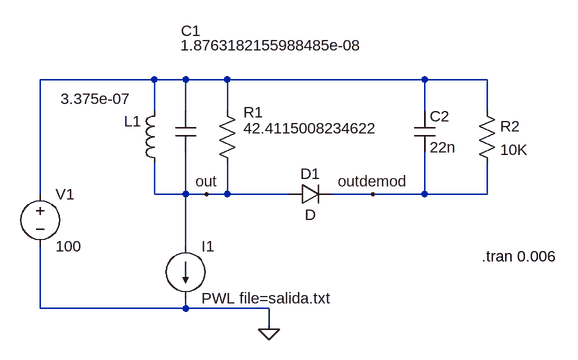
[diagram p0: schematic Doblador Frecuencia.asc]
Doblador Frecuencia.asc, the LTspice schematic file:
Version 4
SHEET 1 880 680
WIRE -48 -160 -224 -160
WIRE 0 -160 -48 -160
WIRE 64 -160 0 -160
WIRE 368 -160 64 -160
WIRE 464 -160 368 -160
WIRE -48 -112 -48 -160
WIRE 0 -112 0 -160
WIRE 64 -112 64 -160
WIRE 368 -112 368 -160
WIRE 464 -112 464 -160
WIRE -224 16 -224 -160
WIRE -48 16 -48 -32
WIRE 0 16 0 -48
WIRE 0 16 -48 16
WIRE 32 16 0 16
WIRE 64 16 64 -32
WIRE 64 16 32 16
WIRE 160 16 64 16
WIRE 288 16 224 16
WIRE 368 16 368 -48
WIRE 368 16 288 16
WIRE 464 16 464 -32
WIRE 464 16 368 16
WIRE 0 96 0 16
WIRE -224 192 -224 96
WIRE 0 192 0 176
WIRE 0 192 -224 192
WIRE 128 192 0 192
WIRE 128 224 128 192
FLAG 128 224 0
FLAG 32 16 out
FLAG 288 16 outdemod
SYMBOL res 48 -128 R0
WINDOW 0 41 18 Left 2
WINDOW 3 41 43 Left 2
SYMATTR InstName R1
SYMATTR Value 42.4115008234622
SYMBOL ind -32 -16 R180
WINDOW 0 36 80 Left 2
WINDOW 3 51 115 Left 2
SYMATTR InstName L1
SYMATTR Value 3.375e-07
SYMBOL current 0 96 R0
WINDOW 123 0 0 Left 2
WINDOW 39 0 0 Left 2
SYMATTR InstName I1
SYMATTR Value PWL file=salida.txt
SYMBOL voltage -224 0 R0
SYMATTR InstName V1
SYMATTR Value 100
SYMBOL cap -16 -112 R0
WINDOW 3 8 -101 Left 2
WINDOW 0 9 -123 Left 2
SYMATTR Value 1.8763182155988485e-08
SYMATTR InstName C1
SYMBOL diode 160 32 R270
WINDOW 0 32 32 VTop 2
WINDOW 3 0 32 VBottom 2
SYMATTR InstName D1
SYMBOL cap 352 -112 R0
SYMATTR InstName C2
SYMATTR Value 22n
SYMBOL res 448 -128 R0
SYMATTR InstName R2
SYMATTR Value 10K
TEXT 456 112 Left 2 !.tran 0.006

The netlist it stands for:
* Doblador Frecuencia.asc
R1 N001 out 42.4115008234622
L1 out N001 3.375e-07
I1 out 0 PWL file=salida.txt
V1 N001 0 100
C1 N001 out 1.8763182155988485e-08
D1 out outdemod D
C2 N001 outdemod 22n
R2 N001 outdemod 10K
.model D D
.lib standard.dio
.tran 0.006
.backanno
.end